# EAGLE board qo-100-gpsdo (EAGLE 9.6.2), part 1 of 2
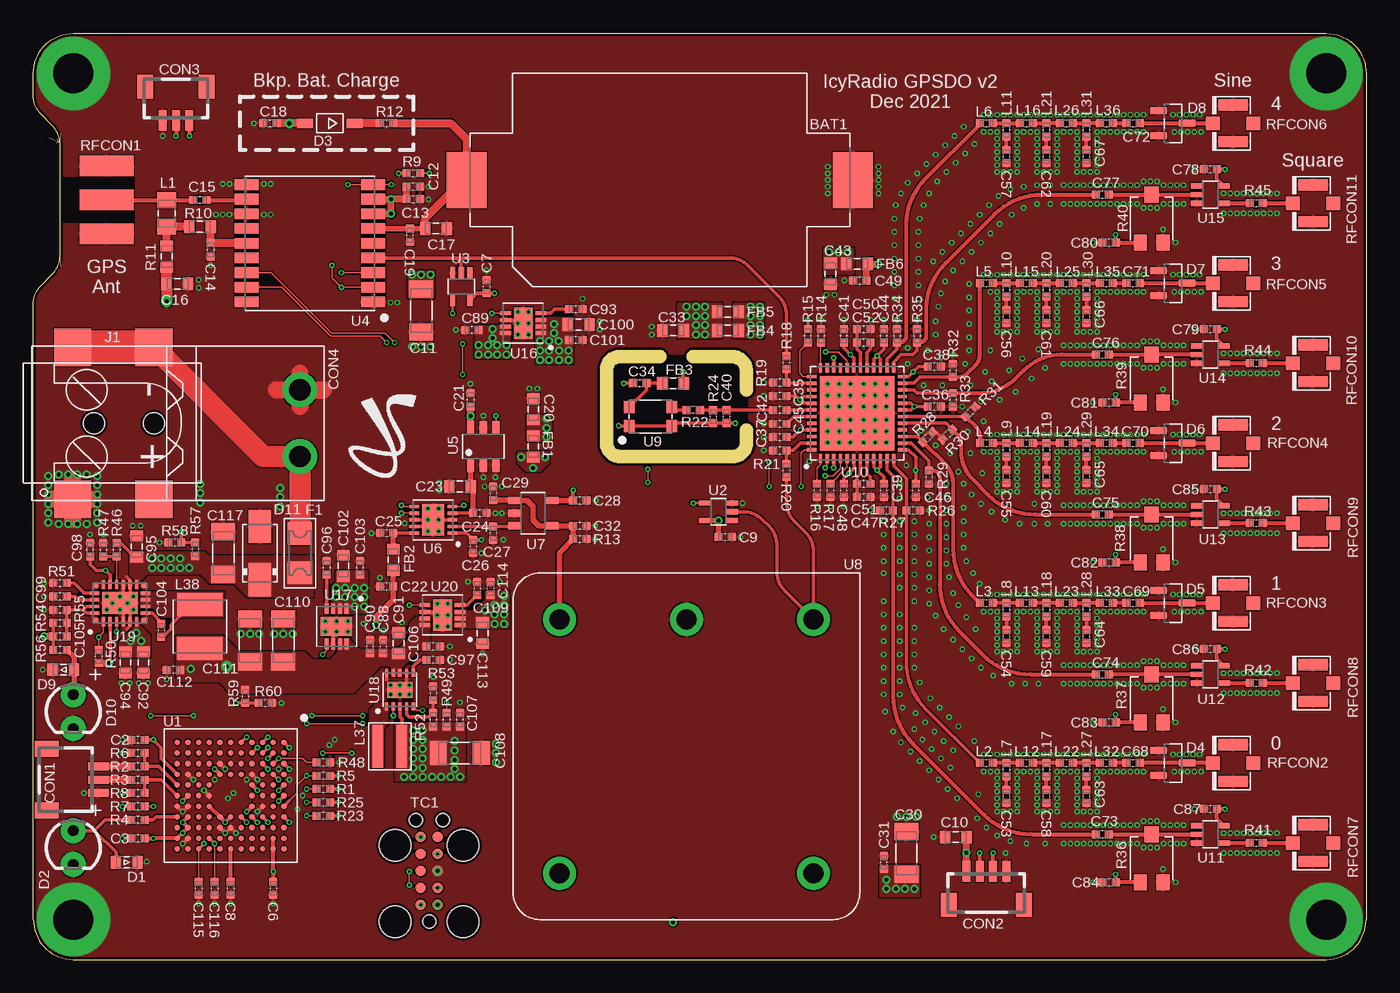
[diagram p12: board, top side]
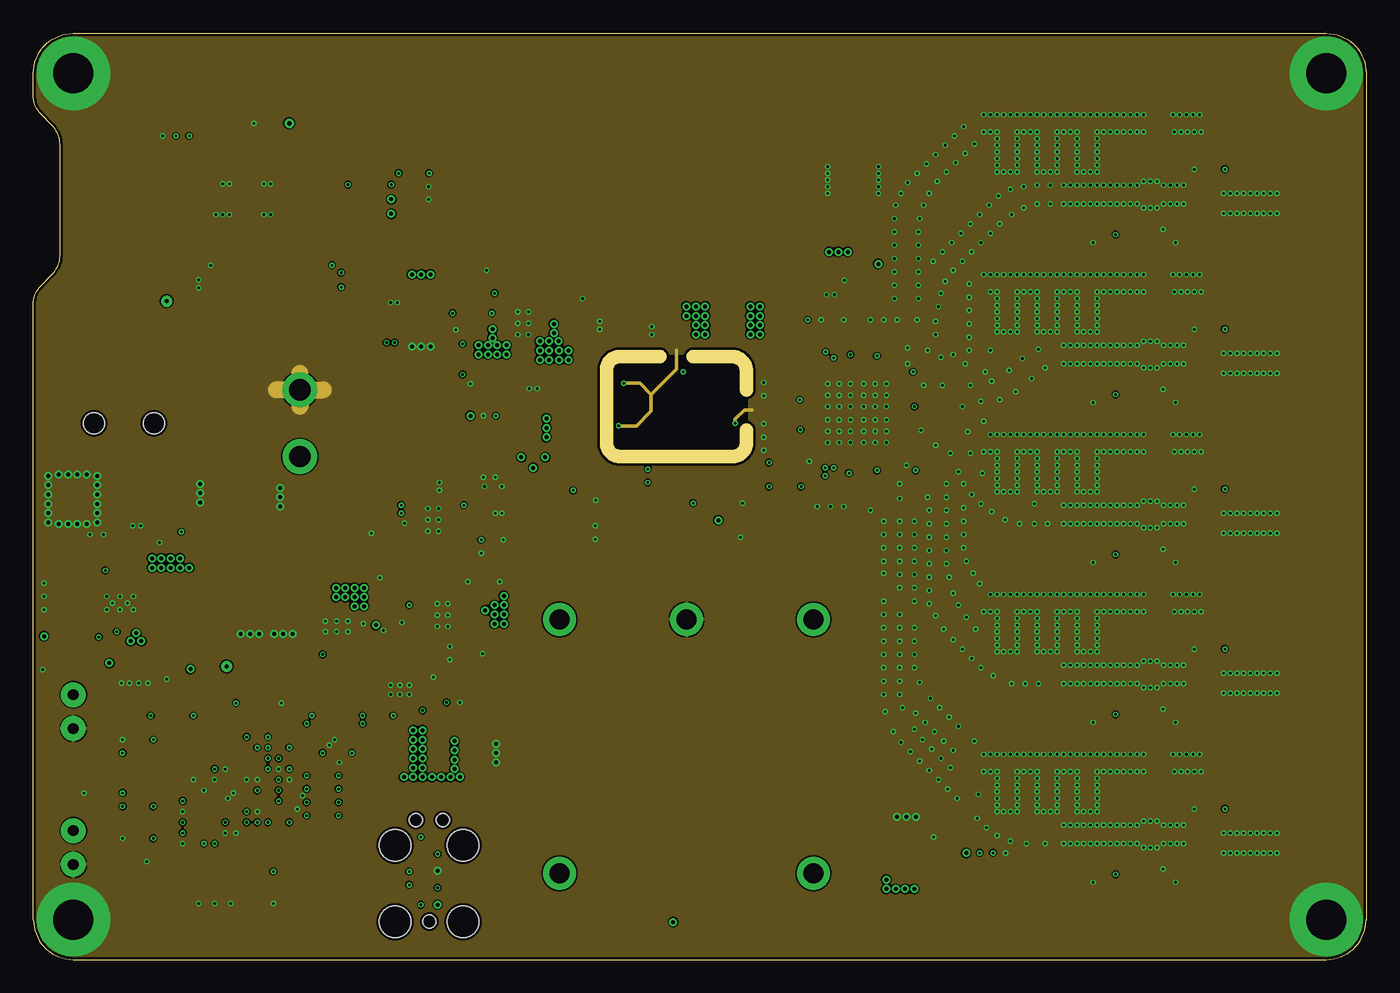
[diagram p13: board, inner layer Route2]
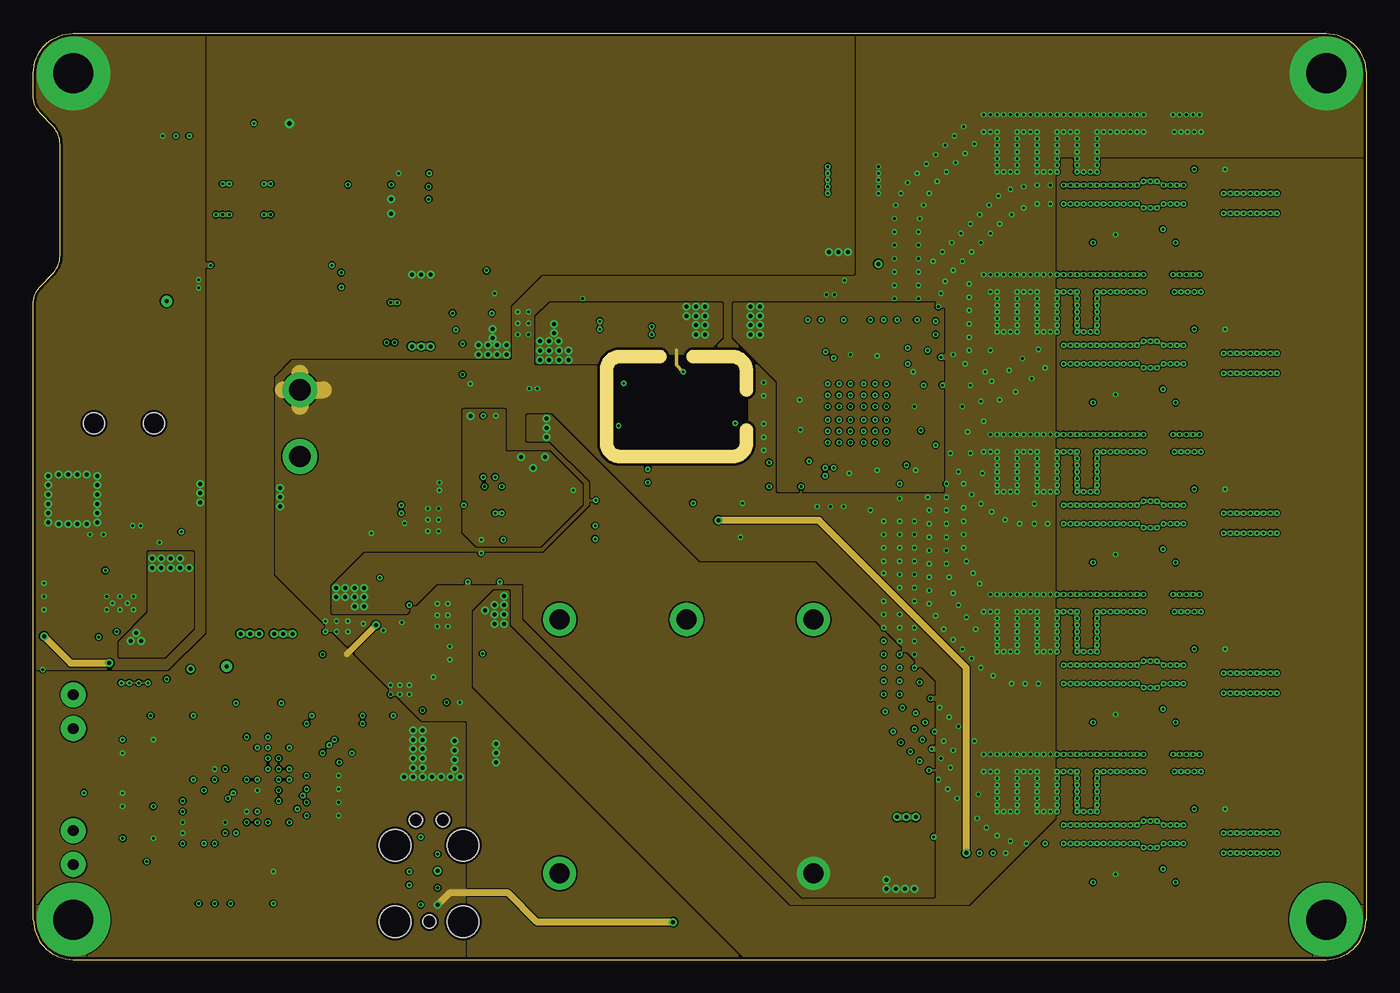
[diagram p14: board, inner layer Route15]
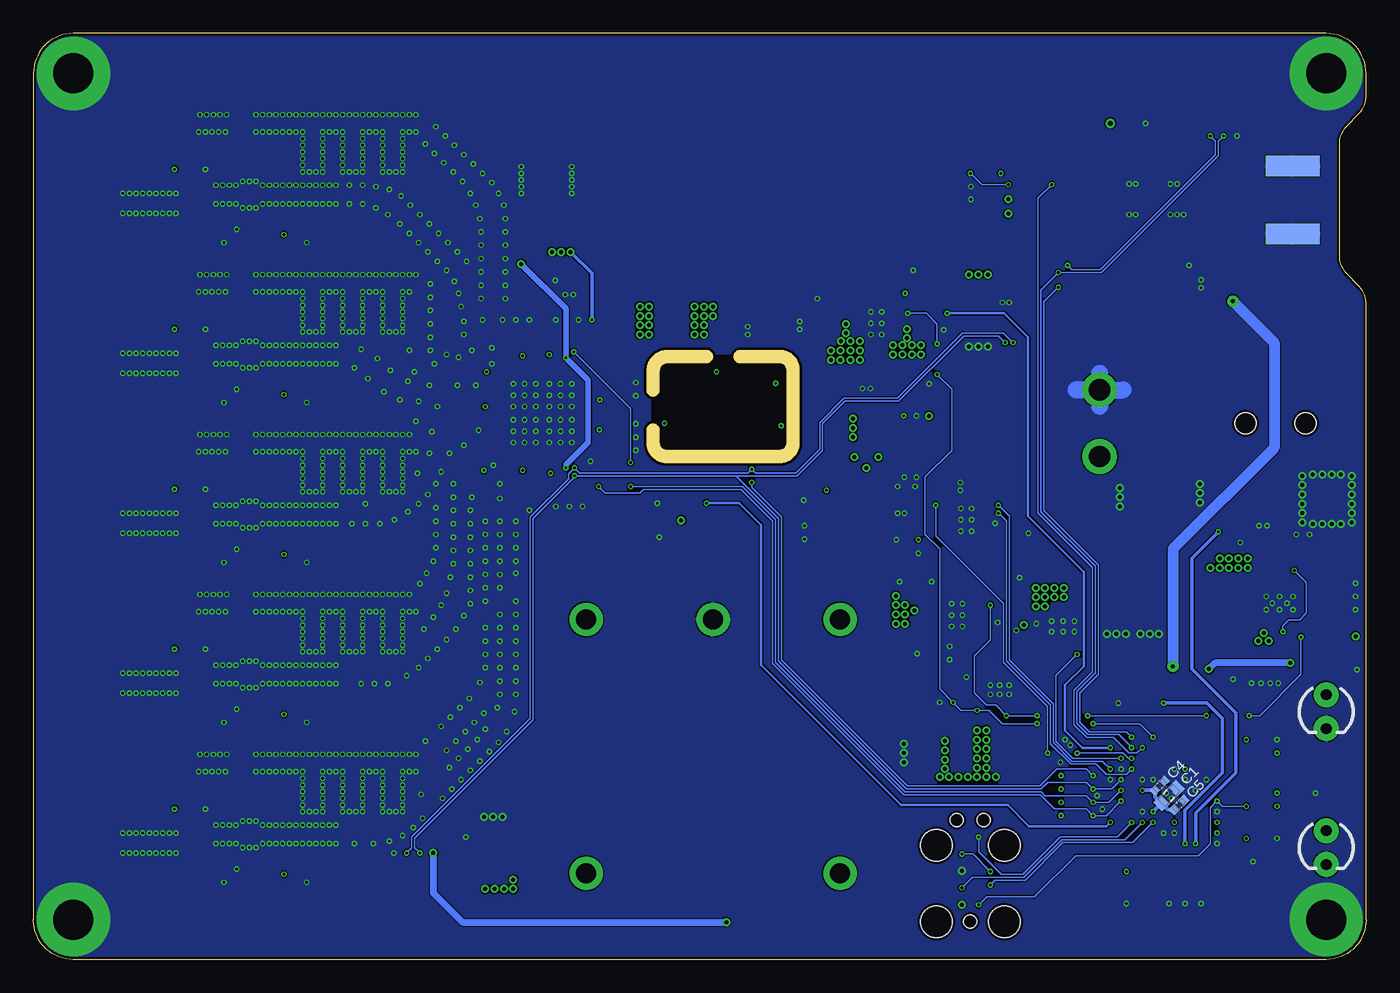
[diagram p15: board, bottom side, seen from below]

Size 100 x 69.5 mm. Coordinates in mm from the lower left corner, seen from the top.
Outline: 49.5,45.25 52.25,45.25 arc-90 53.5,44.25 53.5,42.75
Outline: 53.5,39.75 53.5,38.75 arc-90 52.5,37.75 44,37.75 arc-90 43,38.75 43,44.25 arc-90 44,45.25 47,45.25
Outline: 0,3 0,49.17 arc-45 0.59,50.59 1.41,51.41 arc45 2,52.83 2,61.17 arc45 1.41,62.59 0.59,63.41 arc-45 0,64.83 0,66.5 arc-90 3,69.5 97,69.5 arc-90 100,66.5 100,3 arc-90 97,0 3,0 arc-90 0,3
Copper layers (1+2*15+16): Top 0.035mm / dielectric 0.2mm / Route2 0.0175mm / dielectric 0.665mm / Route15 0.0175mm / dielectric 0.2mm / Bottom 0.035mm
Design rules "jlcpcb_4layer": minimum track width 3.5mil, minimum drill 0.2mm, track to track 3.5mil, track to pad 3.5mil, pad to pad 3.5mil, via to via 5mil, smd to smd 3.5mil, copper to edge 0.2mm, drill to drill 5mil, minimum pad ring 0.15mm, minimum via ring 0.1mm, stop-mask expansion 0.04mm, vias tented up to drill 10mm, thermal gap 3.5mil
tKeepout: area 3,0 to 97,2; area 3,67.5 to 97,69.5
bKeepout: area 3,0 to 97,2; area 3,67.5 to 97,69.5
tRestrict: area 12.3,56.6 to 12.7,57.4; area 71.3,62.4 to 71.7,63.1; area 74.3,62.4 to 74.7,63.1; area 77.3,62.4 to 77.7,63.1; area 80.3,62.4 to 80.7,63.1; area 82.3,62.4 to 82.7,63.1; area 78.6,62 to 79.4,62.5; area 78.6,60 to 79.4,60.5; area 75.6,60 to 76.4,60.5; area 72.6,60 to 73.4,60.5; area 72.6,62 to 73.4,62.5; area 80,57 to 80.4,57.8; 54 more areas
Milling: 10 lines

## Footprints (pad centres in the part's own frame; a part is rotated, then mirrored left to right if it is on the bottom)
CR2032 = smd 3 x 4.2: + 14.5,0; - -14.5,0
CAP0603 = smd 0.8 x 0.95: 1 -0.8,0; 2 0.8,0
CAP0402 = smd 0.6 x 0.6: 1 -0.5,0; 2 0.5,0
CAP1206 = smd 1.3 x 1.8: 1 -1.6,0; 2 1.6,0
SH-03-SIDE = smd 0.6 x 1.55: 1 -1,2.975; 2 0,2.975; 3 1,2.975 | smd 1.2 x 1.8: FIT@1 -2.3,-0.9; FIT@2 2.3,-0.9
SH-04-TOP = smd 0.6 x 1.55: 1 1.5,-1.625; 2 0.5,-1.625; 3 -0.5,-1.625; 4 -1.5,-1.625 | smd 1.2 x 1.8: FIT@1 2.8,0.9; FIT@2 -2.8,0.9
SH-03-TOP = smd 0.6 x 1.55: 1 1,-1.625; 2 0,-1.625; 3 -1,-1.625 | smd 1.2 x 1.8: FIT@1 2.3,0.9; FIT@2 -2.3,0.9
2EDG-2P-5MM = drill 1.6 pad 2.6: P$1 -2.5,0; P$2 2.5,0
0603 = smd 0.8 x 0.95: A 0.8,0; C -0.8,0
LED_3MM = drill 0.813 pad 1.88: A -1.27,0; K 1.27,0
SOD-123 = smd 1.2 x 0.7: A 1.85,0; C -1.85,0
SOT23 = smd 1.219 x 0.533: 1 -1.067,0.94; 2 -1.067,-0.94; 3 1.067,0
DO214AC = smd 2.5 x 1.7: A 2,0; C -2,0
1206 = smd 1.7 x 1.803: 1 -1.472,0; 2 1.472,0
IND0603 = smd 0.8 x 0.95: 1 -0.8,0; 2 0.8,0
DC-050 = smd 2.8 x 2.8: C 5.7,3.05; C' 5.7,-3.05; DT -5.7,-3.05; O -5.7,3.05 | hole 1.6: 0,-3.05; 0,1.45
IND0805 = smd 1.2 x 1.4: 1 -1,0; 2 1,0
IND0402 = smd 0.6 x 0.6: 1 -0.5,0; 2 0.5,0
IND3515 = smd 3.2 x 0.81: 1 0,-0.9; 2 0,0.9
IND0404 = smd 1.75 x 3.4: 1 -1.65,0; 2 1.65,0
RES0402 = smd 0.6 x 0.6: 1 -0.5,0; 2 0.5,0
RES0603 = smd 0.8 x 0.95: 1 -0.8,0; 2 0.8,0
POT3MM = smd 1 x 1.2: 1 -0.85,-1.8; 3 0.85,-1.8 | smd 1.1 x 1.2: 2 0,1.8
SMA-EDGE = smd 1.524 x 4.064: GND@0 -2.54,0; GND@1 2.54,0; SIG 0,0 | smd 1.524 x 4.064 bottom: GND@2 -2.54,0; GND@3 2.54,0
U.FL = smd 2.2 x 0.85: P$1 0,1.375; P$2 0,-1.375 | smd 1.05 x 1: P$3 1.525,0; P$4 -1.525,0
TC2050-IDC = smd 0.787 x 0.787: 1 -2.54,-0.635; 2 -1.27,-0.635; 3 0,-0.635; 4 1.27,-0.635; 5 2.54,-0.635; 6 2.54,0.635; 7 1.27,0.635; 8 0,0.635; 9 -1.27,0.635; 10 -2.54,0.635 | hole 0.991: -3.81,0; 3.81,1.016; 3.81,-1.016 | hole 2.375: -3.81,2.54; -3.81,-2.54; 1.905,2.54; 1.905,-2.54
BGA112 = smd 0.406 x 0.406: A1 -4,4; A2 -3.2,4; A3 -2.4,4; A4 -1.6,4; A5 -0.8,4; A6 0,4; A7 0.8,4; A8 1.6,4; A9 2.4,4; A10 3.2,4; A11 4,4; B1 -4,3.2; B2 -3.2,3.2; B3 -2.4,3.2; B4 -1.6,3.2; B5 -0.8,3.2; B6 0,3.2; B7 0.8,3.2; B8 1.6,3.2; B9 2.4,3.2; B10 3.2,3.2; B11 4,3.2; C1 -4,2.4; C2 -3.2,2.4; C3 -2.4,2.4; C4 -1.6,2.4; C5 -0.8,2.4; C6 0,2.4; C7 0.8,2.4; C8 1.6,2.4; C9 2.4,2.4; C10 3.2,2.4; C11 4,2.4; D1 -4,1.6; D2 -3.2,1.6; D3 -2.4,1.6; D4 -1.6,1.6; D5 -0.8,1.6; D6 0,1.6; D7 0.8,1.6; D8 1.6,1.6; D9 2.4,1.6; D10 3.2,1.6; D11 4,1.6; E1 -4,0.8; E2 -3.2,0.8; E3 -2.4,0.8; E4 -1.6,0.8; E8 1.6,0.8; E9 2.4,0.8; E10 3.2,0.8; E11 4,0.8; F1 -4,0; F2 -3.2,0; F3 -2.4,0; F4 -1.6,0; F8 1.6,0; F9 2.4,0; F10 3.2,0; F11 4,0; G1 -4,-0.8; G2 -3.2,-0.8; G3 -2.4,-0.8; G4 -1.6,-0.8; G8 1.6,-0.8; G9 2.4,-0.8; G10 3.2,-0.8; G11 4,-0.8; H1 -4,-1.6; H2 -3.2,-1.6; H3 -2.4,-1.6; H4 -1.6,-1.6; H5 -0.8,-1.6; H6 0,-1.6; H7 0.8,-1.6; H8 1.6,-1.6; H9 2.4,-1.6; H10 3.2,-1.6; H11 4,-1.6; J1 -4,-2.4; J2 -3.2,-2.4; J3 -2.4,-2.4; J4 -1.6,-2.4; J5 -0.8,-2.4; J6 0,-2.4; J7 0.8,-2.4; J8 1.6,-2.4; J9 2.4,-2.4; J10 3.2,-2.4; J11 4,-2.4; K1 -4,-3.2; K2 -3.2,-3.2; K3 -2.4,-3.2; K4 -1.6,-3.2; K5 -0.8,-3.2; K6 0,-3.2; K7 0.8,-3.2; K8 1.6,-3.2; K9 2.4,-3.2; K10 3.2,-3.2; K11 4,-3.2; L1 -4,-4; L2 -3.2,-4; L3 -2.4,-4; L4 -1.6,-4; L5 -0.8,-4; L6 0,-4; L7 0.8,-4; L8 1.6,-4; L9 2.4,-4; L10 3.2,-4; L11 4,-4
SC70-5 = smd 0.4 x 0.9: 1 -0.65,-1; 2 0,-1; 3 0.65,-1; 4 0.65,1; 5 -0.65,1
MAX-M8 = smd 0.8 x 1.8: 1 -4.4,-4.75; 2 -3.3,-4.75; 3 -2.2,-4.75; 4 -1.1,-4.75; 5 0,-4.75; 6 1.1,-4.75; 7 2.2,-4.75; 8 3.3,-4.75; 9 4.4,-4.75; 10 4.4,4.75; 11 3.3,4.75; 12 2.2,4.75; 13 1.1,4.75; 14 0,4.75; 15 -1.1,4.75; 16 -2.2,4.75; 17 -3.3,4.75; 18 -4.4,4.75
SOT23-6 = smd 1 x 0.55: 1 -1.4,0.95; 2 -1.4,0; 3 -1.4,-0.95; 4 1.4,-0.95; 5 1.4,0; 6 1.4,0.95
DFN10 = smd 0.7 x 0.25: 1 -1.425,1; 2 -1.425,0.5; 3 -1.425,0; 4 -1.425,-0.5; 5 -1.425,-1; 6 1.425,-1; 7 1.425,-0.5; 8 1.425,0; 9 1.425,0.5; 10 1.425,1 | smd 1.65 x 2.38: 11 0,0
SOT23-5 = smd 1 x 0.55: 1 -1.4,0.95; 2 -1.4,0; 3 -1.4,-0.95; 4 1.4,-0.95; 5 1.4,0.95
OSC5A2B02 = drill 1.5 pad 2.5: 1 -9.525,-9.525; 2 0,-9.525; 3 9.525,-9.525; 4 9.525,9.525; 5 -9.525,9.525
TCXO-3225 = smd 0.78 x 0.9: 1 -1.6,-0.7; 2 1.6,-0.7; 3 1.6,0.7; 4 -1.6,0.7
QFN48_2 = smd 0.7 x 0.25: 1 -3.4,2.75; 2 -3.4,2.25; 3 -3.4,1.75; 4 -3.4,1.25; 5 -3.4,0.75; 6 -3.4,0.25; 7 -3.4,-0.25; 8 -3.4,-0.75; 9 -3.4,-1.25; 10 -3.4,-1.75; 11 -3.4,-2.25; 12 -3.4,-2.75; 25 3.4,-2.75; 26 3.4,-2.25; 27 3.4,-1.75; 28 3.4,-1.25; 29 3.4,-0.75; 30 3.4,-0.25; 31 3.4,0.25; 32 3.4,0.75; 33 3.4,1.25; 34 3.4,1.75; 35 3.4,2.25; 36 3.4,2.75 | smd 0.25 x 0.7: 13 -2.75,-3.4; 14 -2.25,-3.4; 15 -1.75,-3.4; 16 -1.25,-3.4; 17 -0.75,-3.4; 18 -0.25,-3.4; 19 0.25,-3.4; 20 0.75,-3.4; 21 1.25,-3.4; 22 1.75,-3.4; 23 2.25,-3.4; 24 2.75,-3.4; 37 2.75,3.4; 38 2.25,3.4; 39 1.75,3.4; 40 1.25,3.4; 41 0.75,3.4; 42 0.25,3.4; 43 -0.25,3.4; 44 -0.75,3.4; 45 -1.25,3.4; 46 -1.75,3.4; 47 -2.25,3.4; 48 -2.75,3.4 | smd 5.6 x 5.6: 49 0,0
LFCSP8_3X3 = smd 0.8 x 0.3: 1 -1.315,0.75; 2 -1.315,0.25; 3 -1.315,-0.25; 4 -1.315,-0.75; 5 1.315,-0.75; 6 1.315,-0.25; 7 1.315,0.25; 8 1.315,0.75 | smd 1.4 x 2.36: 9 0,0
DFN10' = smd 0.6 x 0.25: 1 -1.25,1; 2 -1.25,0.5; 3 -1.25,0; 4 -1.25,-0.5; 5 -1.25,-1; 6 1.25,-1; 7 1.25,-0.5; 8 1.25,0; 9 1.25,0.5; 10 1.25,1 | smd 1.2 x 1.9: 11 0,0
QFN20_ASYM_3X4_CORNER = smd 0.7 x 0.25: 1 -1.4,1.25; 2 -1.4,0.75; 3 -1.4,0.25; 4 -1.4,-0.25; 5 -1.4,-0.75; 6 -1.4,-1.25; 11 1.4,-1.25; 12 1.4,-0.75; 13 1.4,-0.25; 14 1.4,0.25; 15 1.4,0.75; 16 1.4,1.25 | smd 0.25 x 0.7: 7 -0.75,-1.9; 8 -0.25,-1.9; 9 0.25,-1.9; 10 0.75,-1.9; 17 0.75,1.9; 18 0.25,1.9; 19 -0.25,1.9; 20 -0.75,1.9 | smd 1.65 x 2.65: 21 0,0 | smd 0.375 x 0.375: M1 -1.312,1.812; M2 1.312,1.812; M3 -1.312,-1.812; M4 1.312,-1.812

## Placement (x,y rotation side)
BAT1  CR2032  [CR2032]  47,58.5 180 top
C1  10uF  [CAP0603]  14.8,12.3 45 bottom
C2  100nF  [CAP0402]  7.85,16.5 180 top
C3  100nF  [CAP0402]  7.85,9.1 180 top
C4  100nF  [CAP0402]  15.5,13.05 45 bottom
C5  100nF  [CAP0402]  14.05,11.6 45 bottom
C6  100nF  [CAP0402]  18,5.35 270 top
C7  100nF  [CAP0402]  34,50.5 90 top
C8  1uF  [CAP0402]  14.8,5.35 270 top
C9  100nF  [CAP0402]  51.9,31.7 0 top
C10  10uF  [CAP0603]  69.2,9.2 180 top
C11  100uF  [CAP1206]  29.1,48.7 270 top
C12  100nF  [CAP0402]  28.5,58 0 top
C13  100nF  [CAP0402]  28.5,57.05 0 top
C14  100nF  [CAP0402]  13.3,53.25 270 top
C15  47pF  [CAP0402]  12.5,57 180 top
C16  10uF  [CAP0603]  10.8,50.7 0 top
C17  10uF  [CAP0603]  30.2,54.85 0 top
C18  100nF  [CAP0402]  17.75,62.75 180 top
C19  100nF  [CAP0402]  28.25,54.35 270 top
C20  10uF  [CAP0603]  37.5,41.3 90 top
C21  1uF  [CAP0402]  32.8,42 90 top
C22  1uF  [CAP0402]  26.5,28 180 top
C23  10uF  [CAP0603]  32,35.5 180 top
C24  100nF  [CAP0402]  33.5,33.5 0 top
C25  100nF  [CAP0402]  26.5,32 180 top
C26  1uF  [CAP0402]  33,31 270 top
C27  100nF  [CAP0402]  34.5,32 270 top
C28  1uF  [CAP0402]  41,34.45 0 top
C29  100nF  [CAP0402]  34.5,35 90 top
C30  100uF  [CAP1206]  65.5,8 90 top
C31  100nF  [CAP0402]  63.8,7.3 90 top
C32  100nF  [CAP0402]  41,32.55 0 top
C33  10uF  [CAP0603]  48,47.2 180 top
C34  1uF  [CAP0402]  45.5,43.25 180 top
C35  1uF  [CAP0402]  56,42.3 180 top
C36  1uF  [CAP0402]  67.6,41.5 0 top
C37  1uF  [CAP0402]  56,39.2 180 top
C38  1uF  [CAP0402]  67.6,44.5 0 top
C39  1uF  [CAP0402]  63.8,35.2 270 top
C40  10pF  [CAP0402]  52,40.75 270 top
C41  1uF  [CAP0402]  60.8,46.8 90 top
C42  100nF  [CAP0402]  56,41.25 0 top
C43  10uF  [CAP0603]  59.8,51.45 270 top
C44  1uF  [CAP0402]  63.8,46.8 90 top
C45  100nF  [CAP0402]  56,40.2 180 top
C46  1uF  [CAP0402]  66.2,35.2 270 top
C47  220nF  [CAP0402]  62.3,34.7 0 top
C48  1uF  [CAP0402]  60.8,35.2 270 top
C49  1uF  [CAP0402]  62,50.95 180 top
C50  220nF  [CAP0402]  62.3,47.3 0 top
C51  3.9nF  [CAP0402]  62.3,35.7 0 top
C52  3.9nF  [CAP0402]  62.3,46.3 0 top
C53  270pF  [CAP0402]  73,12.25 270 top
C54  270pF  [CAP0402]  73,24.25 270 top
C55  100pF  [CAP0402]  73,36.25 270 top
C56  100pF  [CAP0402]  73,48.25 270 top
C57  68pF  [CAP0402]  73,60.25 270 top
C58  180pF  [CAP0402]  76,12.25 270 top
C59  180pF  [CAP0402]  76,24.25 270 top
C60  68pF  [CAP0402]  76,36.25 270 top
C61  68pF  [CAP0402]  76,48.25 270 top
C62  47pF  [CAP0402]  76,60.25 270 top
C63  180pF  [CAP0402]  79,12.25 270 top
C64  180pF  [CAP0402]  79,24.25 270 top
C65  68pF  [CAP0402]  79,36.25 270 top
C66  68pF  [CAP0402]  79,48.25 270 top
C67  47pF  [CAP0402]  79,60.25 270 top
C68  100nF  [CAP0402]  82.5,14.75 0 top
C69  100nF  [CAP0402]  82.5,26.75 0 top
C70  100nF  [CAP0402]  82.5,38.75 0 top
C71  100nF  [CAP0402]  82.5,50.75 0 top
C72  100nF  [CAP0402]  82.5,62.75 0 top
C73  100nF  [CAP0402]  80.2,9.4 0 top
C74  100nF  [CAP0402]  80.2,21.4 0 top
C75  100nF  [CAP0402]  80.2,33.4 0 top
C76  100nF  [CAP0402]  80.2,45.4 0 top
C77  100nF  [CAP0402]  80.2,57.4 0 top
C78  1uF  [CAP0402]  88.3,59.3 180 top
C79  1uF  [CAP0402]  88.3,47.3 180 top
C80  100nF  [CAP0402]  80.7,53.8 180 top
C81  100nF  [CAP0402]  80.7,41.8 180 top
C82  100nF  [CAP0402]  80.7,29.8 180 top
C83  100nF  [CAP0402]  80.7,17.8 180 top
C84  100nF  [CAP0402]  80.7,5.8 180 top
C85  1uF  [CAP0402]  88.3,35.3 180 top
C86  1uF  [CAP0402]  88.3,23.3 180 top
C87  1uF  [CAP0402]  88.3,11.3 180 top
C88  100nF  [CAP0402]  26.25,23.5 90 top
C89  100nF  [CAP0402]  32.9,47.25 180 top
C90  100nF  [CAP0402]  25.25,23.5 90 top
C91  4.7uF  [CAP0603]  27.4,23.75 90 top
C92  4.7uF  [CAP0603]  8.25,22.3 270 top
C93  10nF  [CAP0402]  40.7,48.8 0 top
C94  1uF  [CAP0603]  6.9,22.3 270 top
C95  1uF  [CAP0603]  7.75,31 90 top
C96  10nF  [CAP0402]  22,29.4 90 top
C97  470pF  [CAP0402]  30,22.5 0 top
C98  1uF  [CAP0402]  4.25,30.75 90 top
C99  10nF  [CAP0402]  2,27.25 180 top
C100  10uF  [CAP0603]  40.9,47.65 0 top
C101  100nF  [CAP0402]  40.7,46.5 0 top
C102  10uF  [CAP0603]  23.25,29.55 90 top
C103  100nF  [CAP0402]  24.5,29.4 90 top
C104  100nF  [CAP0402]  9.6,24.7 90 top
C105  10pF  [CAP0402]  2,24.25 0 top
C106  100nF  [CAP0402]  30,23.5 0 top
C107  100nF  [CAP0402]  32,18 90 top
C108  100uF  [CAP1206]  32,15.5 0 top
C109  10nF  [CAP0402]  33.3,27.85 90 top
C110  100uF  [CAP1206]  18.75,23.95 90 top
C111  100uF  [CAP1206]  16.25,23.95 90 top
C112  100nF  [CAP0402]  10.5,21.75 180 top
C113  10uF  [CAP0603]  33.7,24.5 270 top
C114  100nF  [CAP0402]  34.3,27.85 90 top
C115  470pF  [CAP0402]  12.4,5.35 270 top
C116  470pF  [CAP0402]  13.6,5.35 270 top
C117  10uF  [CAP1206]  14.25,30.5 90 top
CON1  3P-SH-SIDE  [SH-03-SIDE]  1.9,13.5 270 top
CON2  4P-SH-TOP  [SH-04-TOP]  71.5,5 180 top
CON3  3P-SH-TOP  [SH-03-TOP]  10.7,64.6 0 top
CON4  2EDG-2P-5MM  [2EDG-2P-5MM]  20,40.25 270 top
D1  LED0603  [0603]  7,7.3 180 top
D2  LEDTH3MM  [LED_3MM]  3,8.4 270 top
D3  B0530W  [SOD-123]  22.25,62.75 180 top
D4  BAV99  [SOT23]  85.5,14.75 0 top
D5  BAV99  [SOT23]  85.5,26.75 0 top
D6  BAV99  [SOT23]  85.5,38.75 0 top
D7  BAV99  [SOT23]  85.5,50.75 0 top
D8  BAV99  [SOT23]  85.5,62.75 0 top
D9  LED0603  [0603]  2.25,21.75 0 top
D10  LEDTH3MM  [LED_3MM]  3,18.6 270 top
D11  SMAJ24A  [DO214AC]  17,30.5 90 top
F1  2.6A Hold  [1206]  20,30.5 90 top
FB1  1uH  [IND0603]  37.5,38.5 270 top
FB2  1uH  [IND0603]  27,30 90 top
FB3  10uH  [IND0603]  48,43.25 180 top
FB4  1uH  [IND0603]  52.1,47.2 0 top
FB5  1uH  [IND0603]  52.1,48.6 0 top
FB6  1uH  [IND0603]  61.8,52.2 0 top
J1  DCJACK  [DC-050]  6,40.25 90 top
L1  27nH  [IND0805]  10,56 270 top
L2  560nH  [IND0402]  71.5,14.75 0 top
L3  560nH  [IND0402]  71.5,26.75 0 top
L4  220nH  [IND0402]  71.5,38.75 0 top
L5  220nH  [IND0402]  71.5,50.75 0 top
L6  150nH  [IND0402]  71.5,62.75 0 top
L7  82nH  [IND0402]  73,14.25 270 top
L8  82nH  [IND0402]  73,26.25 270 top
L9  33nH  [IND0402]  73,38.25 270 top
L10  33nH  [IND0402]  73,50.25 270 top
L11  22nH  [IND0402]  73,62.25 270 top
L12  820nH  [IND0402]  74.5,14.75 0 top
L13  820nH  [IND0402]  74.5,26.75 0 top
L14  270nH  [IND0402]  74.5,38.75 0 top
L15  270nH  [IND0402]  74.5,50.75 0 top
L16  180nH  [IND0402]  74.5,62.75 0 top
L17  470nH  [IND0402]  76,14.25 270 top
L18  470nH  [IND0402]  76,26.25 270 top
L19  180nH  [IND0402]  76,38.25 270 top
L20  180nH  [IND0402]  76,50.25 270 top
L21  120nH  [IND0402]  76,62.25 270 top
L22  680nH  [IND0402]  77.5,14.75 0 top
L23  680nH  [IND0402]  77.5,26.75 0 top
L24  270nH  [IND0402]  77.5,38.75 0 top
L25  270nH  [IND0402]  77.5,50.75 0 top
L26  180nH  [IND0402]  77.5,62.75 0 top
L27  330nH  [IND0402]  79,14.25 270 top
L28  330nH  [IND0402]  79,26.25 270 top
L29  120nH  [IND0402]  79,38.25 270 top
L30  120nH  [IND0402]  79,50.25 270 top
L31  82nH  [IND0402]  79,62.25 270 top
L32  390nH  [IND0402]  80.5,14.75 0 top
L33  390nH  [IND0402]  80.5,26.75 0 top
L34  150nH  [IND0402]  80.5,38.75 0 top
L35  150nH  [IND0402]  80.5,50.75 0 top
L36  100nH  [IND0402]  80.5,62.75 0 top
L37  2.2uH  [IND3515]  26.75,16 270 top
L38  4.7uH  [IND0404]  12.5,25 270 top
LOGO1  JS-5MM  [JS_5MM]  28.9,42.6 0 top
R1  4.7K Ohms  [RES0402]  21.75,12.8 0 top
R2  100 Ohms  [RES0402]  7.85,14.5 0 top
R3  100 Ohms  [RES0402]  7.85,13.5 0 top
R4  330 Ohms  [RES0402]  7.85,10.5 0 top
R5  4.7K Ohms  [RES0402]  21.75,13.8 0 top
R6  4.7K Ohms  [RES0402]  7.85,15.5 180 top
R7  10K Ohms  [RES0402]  7.85,11.5 180 top
R8  4.7K Ohms  [RES0402]  7.85,12.5 180 top
R9  10K Ohms  [RES0402]  28.5,59 180 top
R10  10 Ohms  [RES0603]  12.5,55 0 top
R11  DNP  [RES0603]  10,52.75 90 top
R12  1K Ohms  [RES0402]  26.5,62.75 180 top
R13  470 Ohms  [RES0402]  41,31.55 180 top
R14  10K Ohms  [RES0402]  59.1,46.8 270 top
R15  10K Ohms  [RES0402]  58.1,46.8 90 top
R16  10K Ohms  [RES0402]  58.8,35.2 90 top
R17  10K Ohms  [RES0402]  59.8,35.2 90 top
R18  280 Ohms  [RES0402]  56.5,44.8 90 top
R19  330 Ohms  [RES0402]  56,43.3 0 top
R20  510 Ohms  [RES0402]  56.5,36.7 270 top
R21  270 Ohms  [RES0402]  56,38.2 0 top
R22  0 Ohms  [RES0402]  49.5,41.25 180 top
R23  10K Ohms  [RES0402]  21.75,10.8 0 top
R24  10K Ohms  [RES0402]  51,40.75 90 top
R25  10K Ohms  [RES0402]  21.75,11.8 0 top
R26  49.9 Ohms  [RES0402]  66,33.7 180 top
R27  100 Ohms  [RES0402]  64,33.7 0 top
R28  49.9 Ohms  [RES0402]  67.1,39.2 225 top
R29  100 Ohms  [RES0402]  67.2,36.2 90 top
R30  49.9 Ohms  [RES0402]  70.3,41.1 225 top
R31  100 Ohms  [RES0402]  68.6,39.4 45 top
R32  49.9 Ohms  [RES0402]  69,44.2 270 top
R33  100 Ohms  [RES0402]  69,42 90 top
R34  49.9 Ohms  [RES0402]  64.8,46.8 270 top
R35  100 Ohms  [RES0402]  66.3,46.8 270 top
R36  100K Ohms  [POT3MM]  83.9,7.6 0 top
R37  100K Ohms  [POT3MM]  83.9,19.6 0 top
R38  100K Ohms  [POT3MM]  83.9,31.6 0 top
R39  100K Ohms  [POT3MM]  83.9,43.6 0 top
R40  100K Ohms  [POT3MM]  83.9,55.6 0 top
R41  0 Ohms  [RES0402]  91.75,8.75 180 top
R42  0 Ohms  [RES0402]  91.75,20.75 180 top
R43  0 Ohms  [RES0402]  91.75,32.75 180 top
R44  0 Ohms  [RES0402]  91.75,44.75 180 top
R45  0 Ohms  [RES0402]  91.75,56.75 180 top
R46  75K Ohms  [RES0402]  6.25,30.75 90 top
R47  10K Ohms  [RES0402]  5.25,30.75 270 top
R48  10K Ohms  [RES0402]  21.75,14.8 180 top
R49  10K Ohms  [RES0402]  31,18 270 top
R50  10K Ohms  [RES0402]  4.9,22.75 270 top
R51  41.2K Ohms  [RES0402]  2,28.25 0 top
R52  309K Ohms  [RES0402]  30,18 270 top
R53  71.5K Ohms  [RES0402]  30,20 270 top
R54  1M Ohms  [RES0402]  2,25.25 180 top
R55  226K Ohms  [RES0402]  2,26.25 0 top
R56  510 Ohms  [RES0402]  2,23.25 180 top
R57  100K Ohms  [RES0402]  12.15,30.8 270 top
R58  10K Ohms  [RES0402]  10.6,31.3 0 top
R59  100K Ohms  [RES0402]  15.9,19.75 90 top
R60  75K Ohms  [RES0402]  17.4,19.25 180 top
RFCON1  RFCON-SMA-EDGE  [SMA-EDGE]  5.5,57 270 top
RFCON2  RFCON-U.FL  [U.FL]  90,14.75 180 top
RFCON3  RFCON-U.FL  [U.FL]  90,26.75 180 top
RFCON4  RFCON-U.FL  [U.FL]  90,38.75 180 top
RFCON5  RFCON-U.FL  [U.FL]  90,50.75 180 top
RFCON6  RFCON-U.FL  [U.FL]  90,62.75 180 top
RFCON7  RFCON-U.FL  [U.FL]  96,8.75 180 top
RFCON8  RFCON-U.FL  [U.FL]  96,20.75 180 top
RFCON9  RFCON-U.FL  [U.FL]  96,32.75 180 top
RFCON10  RFCON-U.FL  [U.FL]  96,44.75 180 top
RFCON11  RFCON-U.FL  [U.FL]  96,56.75 180 top
TC1  TC2050-IDC  [TC2050-IDC]  29.7,6.65 90 top
U1  EFM32GG11B420F2048GL112  [BGA112]  14.8,12.3 270 top
U2  74LVC1G17  [SC70-5]  51.4,33.6 90 top
U3  74LVC1G17  [SC70-5]  32.1,50.5 180 top
U4  MAX-M8Q  [MAX-M8]  20.75,53.75 90 top
U5  MCP1501-40  [SOT23-6]  33.75,38.5 90 top
U6  AD5541ACPZ  [DFN10]  30,33 180 top
U7  MCP6V31  [SOT23-5]  37.5,33.5 0 top
U8  OSC5A2B02  [OSC5A2B02]  49,16 180 top
U9  DSB321SDA  [TCXO-3225]  46.3,40.75 0 top
U10  AD9544  [QFN48_2]  61.8,41 90 top
U11  74LVC1G17  [SC70-5]  88.3,9.4 270 top
U12  74LVC1G17  [SC70-5]  88.3,21.4 270 top
U13  74LVC1G17  [SC70-5]  88.3,33.4 270 top
U14  74LVC1G17  [SC70-5]  88.3,45.4 270 top
U15  74LVC1G17  [SC70-5]  88.3,57.4 270 top
U16  ADM7171ACPZ-1.8  [LFCSP8_3X3]  36.75,47.75 180 top
U17  ADM7171ACPZ-5.0  [LFCSP8_3X3]  22.75,25 270 top
U18  MIC23155  [DFN10']  27.5,20.25 90 top
U19  LT8636  [QFN20_ASYM_3X4_CORNER]  6.5,26.75 90 top
U20  ADM7171ACPZ-3.3  [LFCSP8_3X3]  30.7,25.85 180 top